# EAGLE design badge1 (EAGLE 7.3.0)
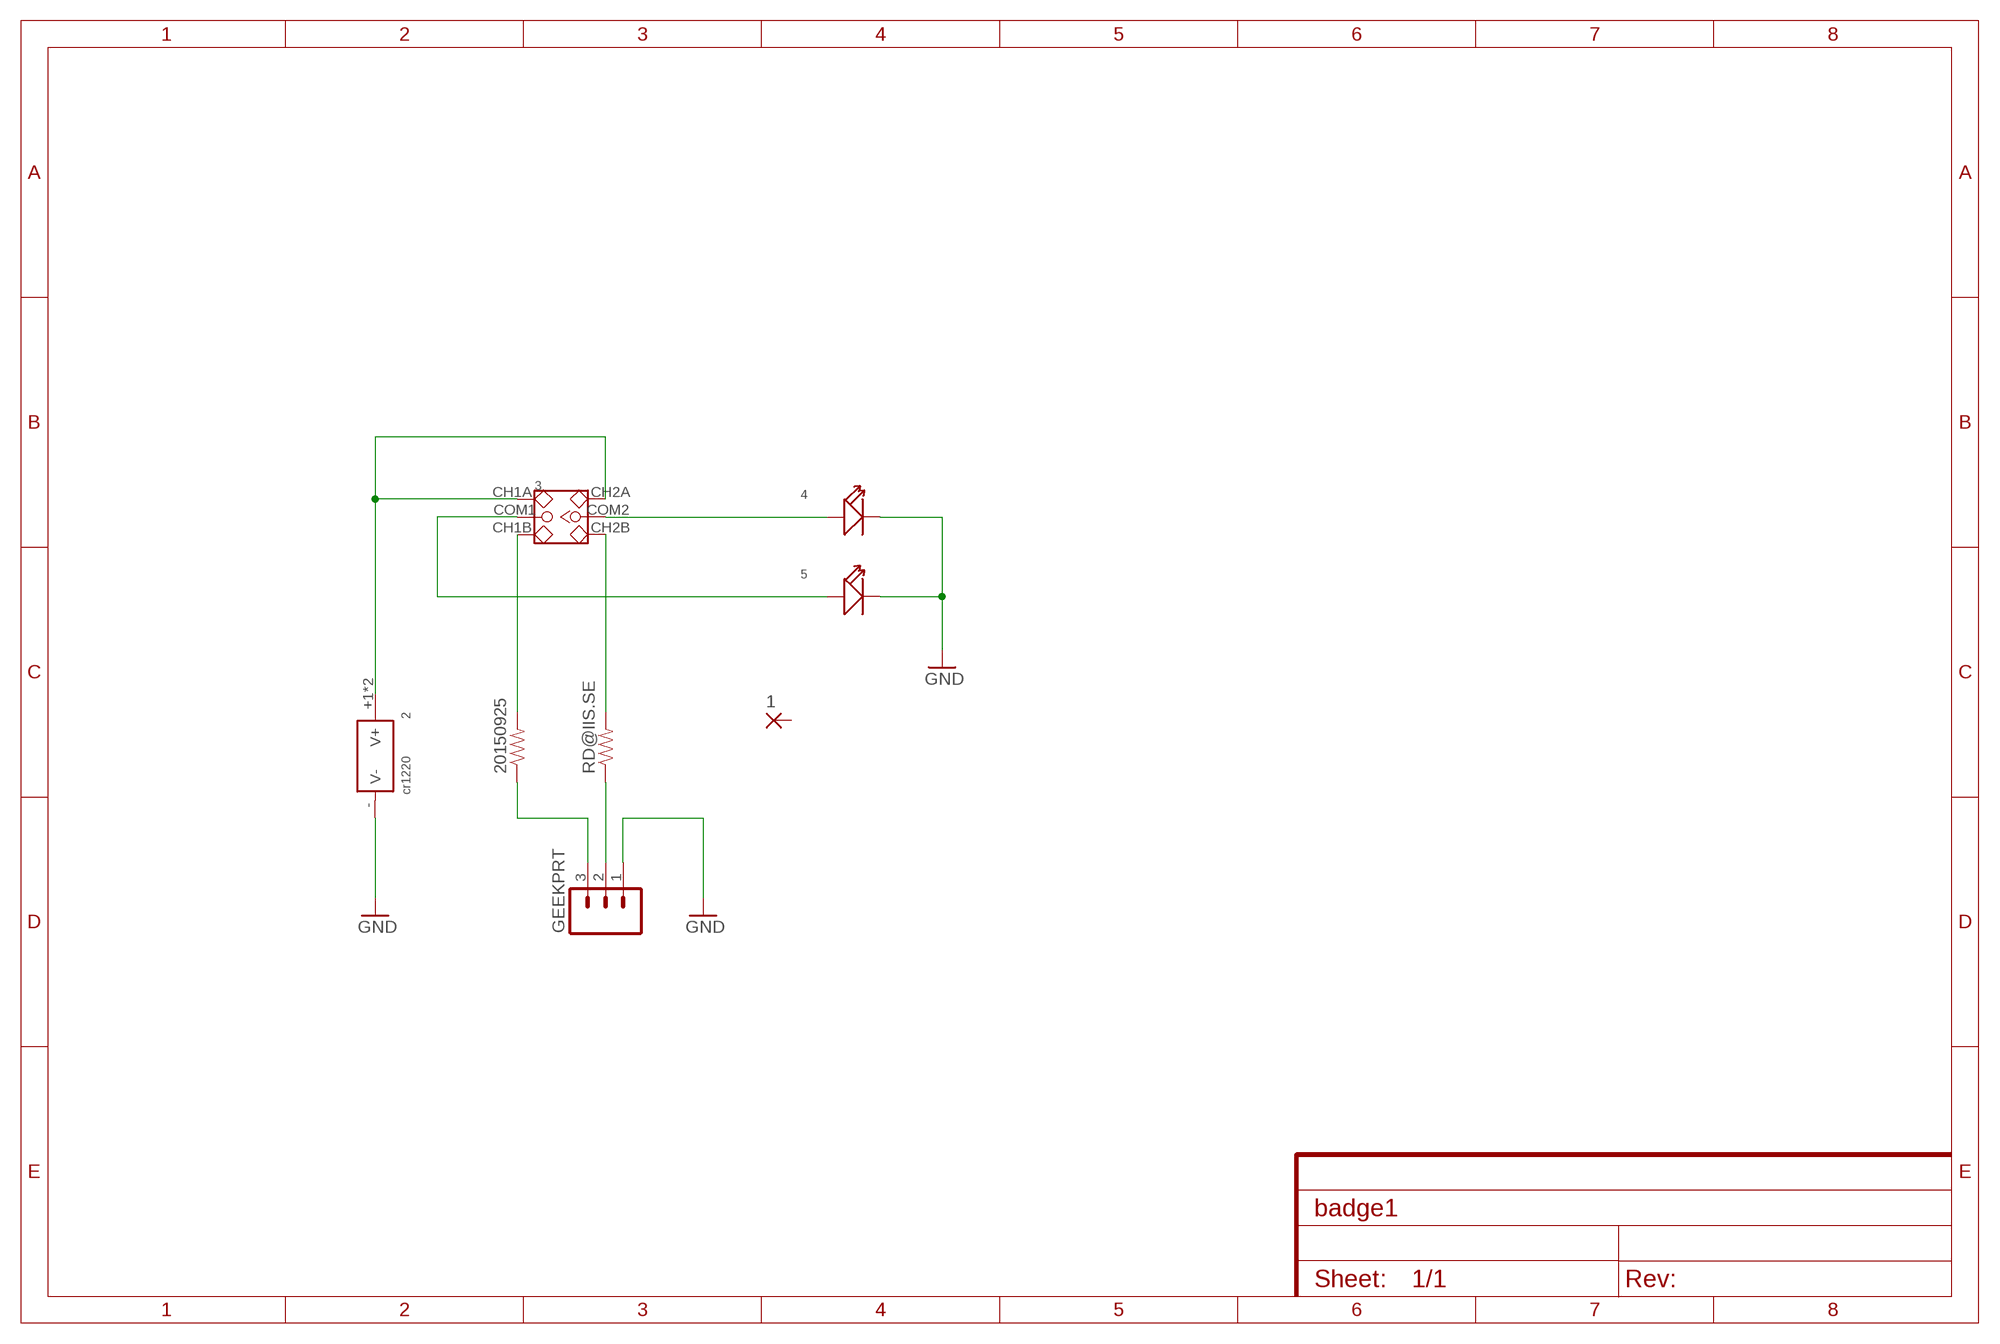
[diagram p0: schematic, sheet 1]

## Parts
1  3,81/1,4  [3,81/1,4]
2  cr1220  DIP-BATTERY-CELL-HOLDER(1220)  [BAT2P-13.5-CR1220]
3  DIP-TOGGLE-SWITCH-2CH-(2X3P-2.54-90D)'90D'  [SW6-2.54-9.0X3.5X3.2MM-90D]
4  LED'5MM'  [LED2-2.54-D5.0MM]
5  LED'5MM'  [LED2-2.54-D5.0MM]
20150925  RESISTORPTH-1/4W  [AXIAL-0.4]
GEEKPRT  M03LOCK  [1X03_LOCK]
RD@IIS.SE  RESISTORPTH-1/4W  [AXIAL-0.4]

## Nets
GND: 2.-(V-) 4.- 5.- GEEKPRT.1
N$1: 3.COM2 4.+
N$2: 3.COM1 5.+
N$3: 2.+1(V+) 2.+2(V+) 3.CH1A 3.CH2A
N$4: GEEKPRT.2 RD@IIS.SE.P$1
N$5: 3.CH1B 20150925.P$2
N$6: 3.CH2B RD@IIS.SE.P$2
N$7: 20150925.P$1 GEEKPRT.3
Unconnected: 1.1(P)

## Library data of the parts
1 = wirepad:3,81/1,4: THROUGH-HOLE PAD
2 = Seeed-OPL-Connector:DIP-BATTERY-CELL-HOLDER(1220): 320170002
3 = Seeed-OPL-Switch:DIP-TOGGLE-SWITCH-2CH-(2X3P-2.54-90D): 311030004
4 5 = Discrete-new:LED
20150925 RD@IIS.SE = SparkFun-Passives:RESISTOR: Resistor Basic schematic elements and footprints for 0603, 1206, and PTH resistors.
GEEKPRT = SparkFun-Connectors:M03: Header 3 Standard 3-pin 0.1" header. Use with straight break away headers (SKU : PRT-00116), right angle break away headers (PRT-00553), swiss pins (PRT-00743), machine pins (PRT-00117), and female headers (PRT-00115). Molex polarized connector foot print use with SKU : PRT-08232 with associated crimp pins and housings.

## Board
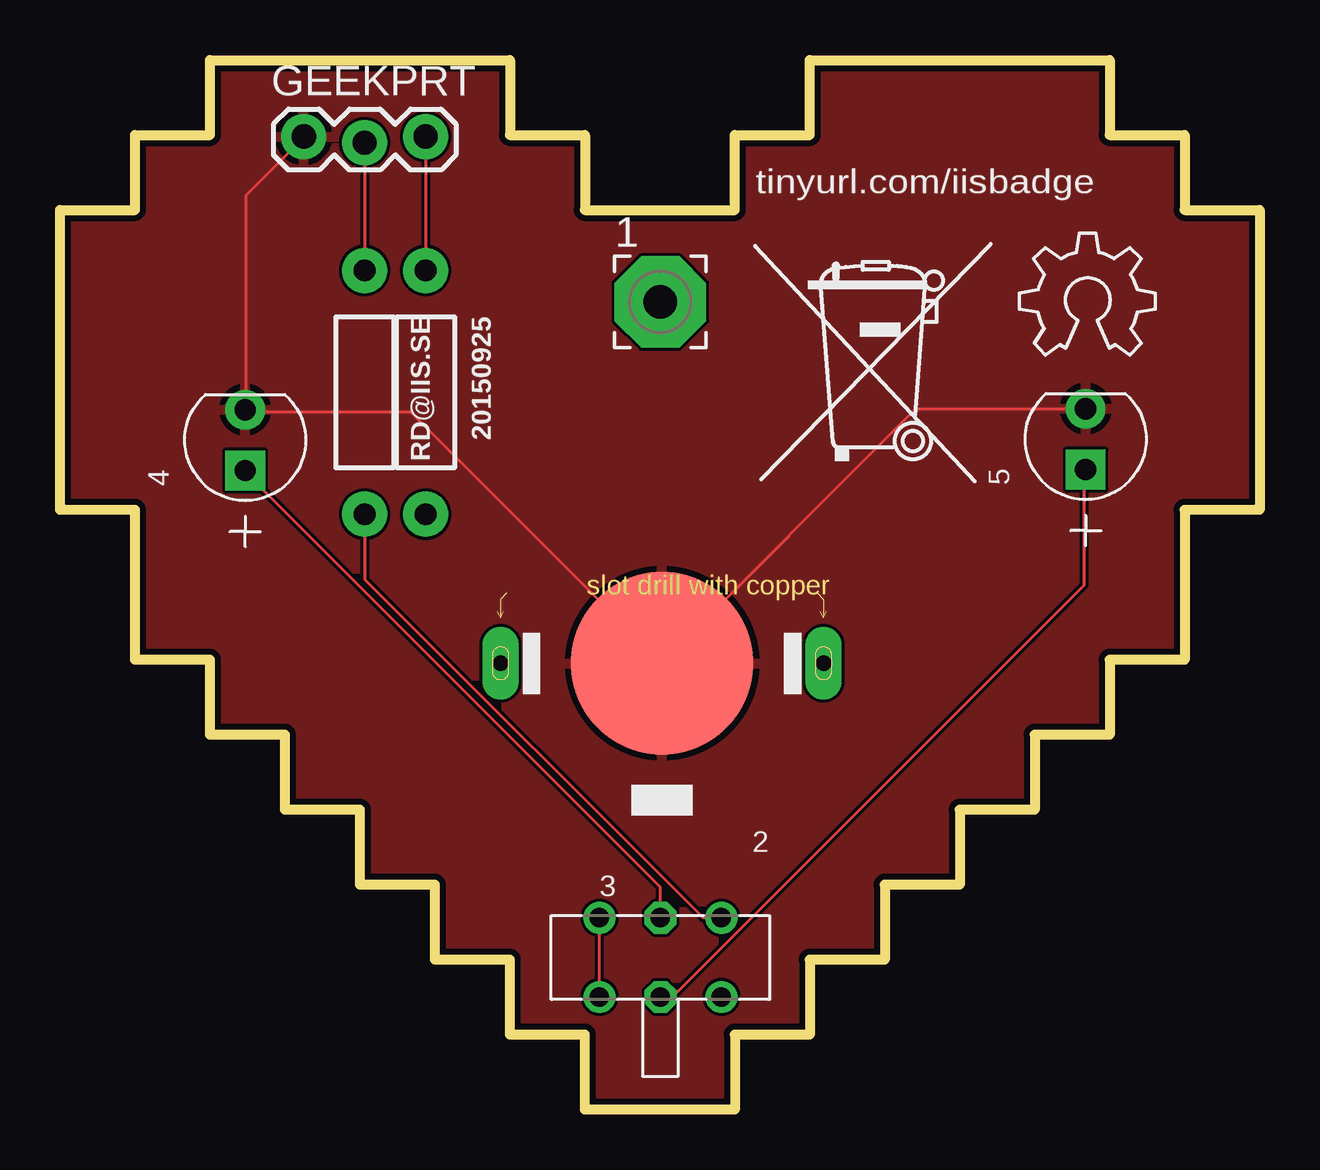
[diagram p1: board, top side]
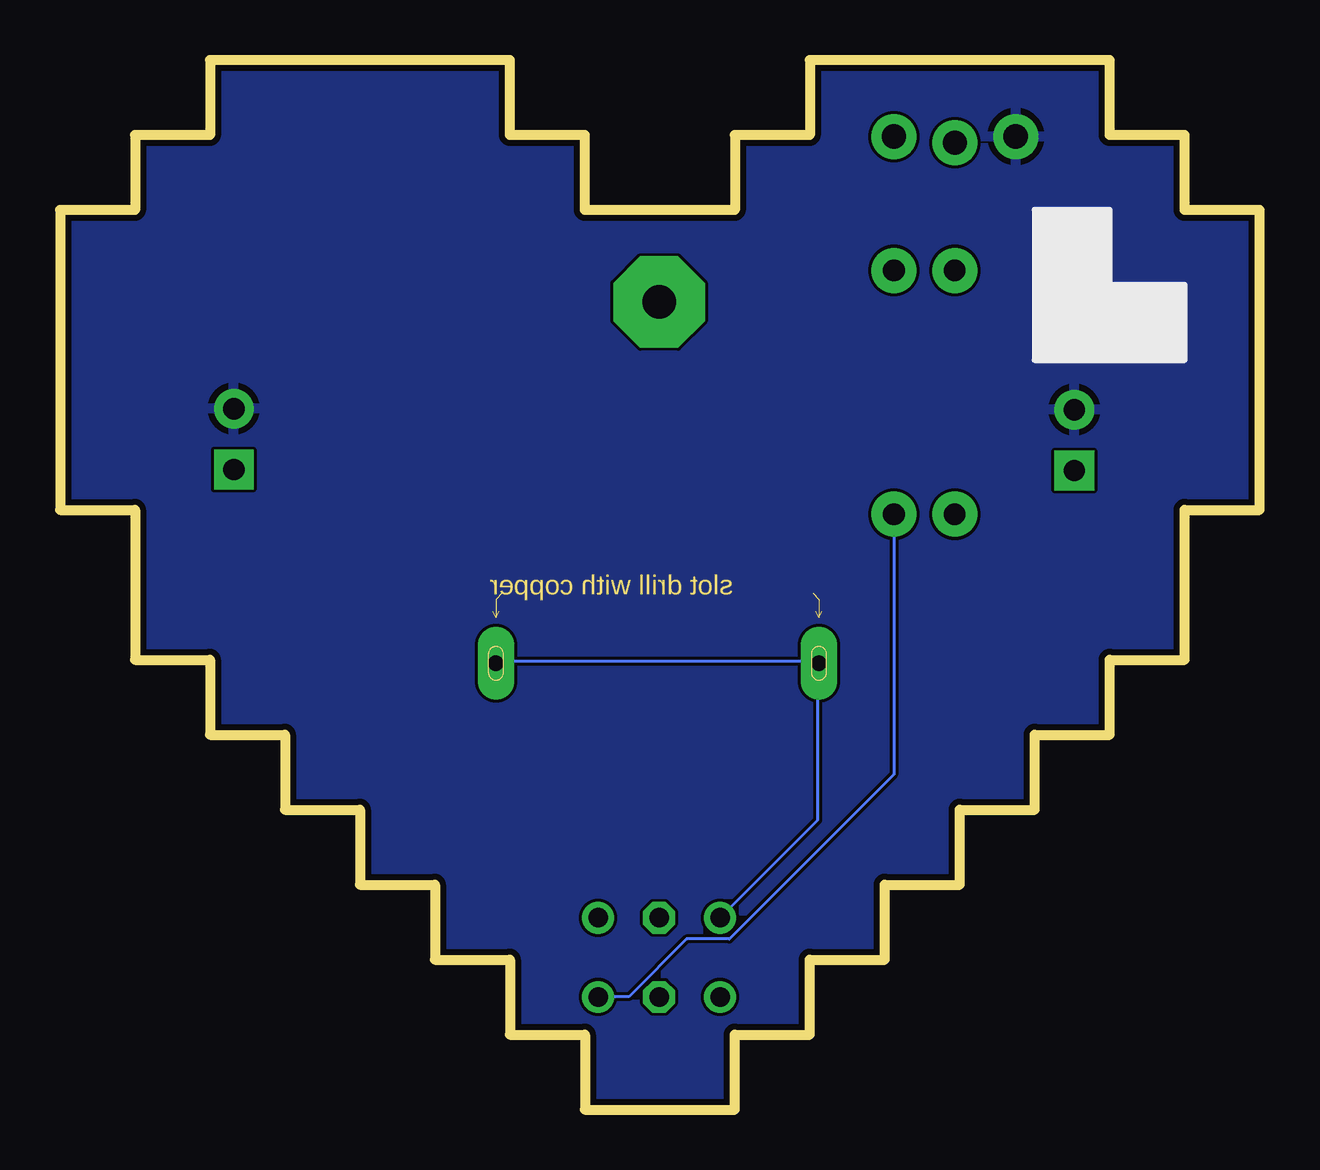
[diagram p2: board, bottom side, seen from below]

Size 50 x 43.75 mm. Coordinates in mm from the lower left corner, seen from the top.
Outline: 0,37.5 3.12,37.5 3.12,40.62 6.25,40.62 6.25,43.75 18.75,43.75 18.75,40.62 21.88,40.62 21.88,37.5 28.12,37.5 28.12,40.62 31.25,40.62 31.25,43.75 43.75,43.75 43.75,40.62 46.88,40.62 46.88,37.5 50,37.5 50,25 46.88,25 46.88,18.75 43.75,18.75 43.75,15.62 40.62,15.62 40.62,12.5 37.5,12.5 37.5,9.38 34.38,9.38 34.38,6.25 31.25,6.25 31.25,3.12 28.12,3.12 28.12,0 21.88,0 21.88,3.12 18.75,3.12 18.75,6.25 15.62,6.25 15.62,9.38 12.5,9.38 12.5,12.5 9.38,12.5 9.38,15.62 6.25,15.62 6.25,18.75 3.12,18.75 3.12,25 0,25 0,37.5
Copper layers (1*16): Top 0.035mm / dielectric 1.5mm / Bottom 0.035mm
Design rules "dirt_cheap_dirty_boards.v1": minimum track width 5mil, minimum drill 12mil, track to track 5mil, track to pad 5mil, pad to pad 5mil, via to via 5mil, smd to smd 0mil, copper to edge 10mil, drill to drill 10mil, minimum pad ring 10mil, minimum via ring 6mil, stop-mask expansion 2mil, vias tented up to drill 25mil, thermal gap 10mil

### Footprints (pad centres in the part's own frame; a part is rotated, then mirrored left to right if it is on the bottom)
3,81/1,4 = drill 1.397 pad 3.81 octagon: 1 0,0
BAT2P-13.5-CR1220 = drill 0.635 pad 1.524 long: +1 6.731,0; +2 -6.731,0 | smd 7.62 x 7.62: - 0,0
SW6-2.54-9.0X3.5X3.2MM-90D = drill 0.813 pad 1.27: CH1A -2.54,-1.65; CH1B 2.54,-1.65; CH2A -2.54,1.65; CH2B 2.54,1.65 | drill 0.813 pad 1.27 octagon: COM1 0,-1.65; COM2 0,1.65
LED2-2.54-D5.0MM = drill 0.889 pad 1.651 square: + -1.27,0 | drill 0.889 pad 1.651: - 1.27,0
AXIAL-0.4 = drill 0.9 pad 1.88: P$1 -5.08,0; P$2 5.08,0
1X03_LOCK = drill 1.016 pad 1.88: 1 0,0.127; 2 2.54,-0.127; 3 5.08,0.127

### Placement (x,y rotation side)
1  25.03,33.66 0 top
2  25.1,18.6 180 top
3  25.03,6.34 0 top
4  7.72,27.9 90 top
5  42.75,27.94 90 top
20150925  15.24,29.89 270 top
GEEKPRT  10.16,40.43 0 top
RD@IIS.SE  12.7,29.89 270 top
U$1  [OSHW_6X200_NOTEXT]  40,31.46 0 top
U$3  [MUELLTONNE_10.00]  28.31,25.77 0 top

### Tracks (layer width: path | path; a pad name or v marks a point on that pad's centre or on a via)
GND
  Top 0.127: GEEKPRT.1 10.16,40.51 7.75,38.1 7.75,29.21 4.- 7.75,29.08 14.61,29.08 25.02,18.67 2.- 25.15,18.67 35.69,29.21 42.67,29.21 5.-
  pour Top: -9.38,50 56.25,50 56.25,-3.12 -9.38,-3.12
  pour Bottom: -12.5,53.12 56.25,53.12 56.25,50 56.25,-6.25 -12.5,-6.25
N$1
  Top 0.127: 3.COM2 25.02,8 25.02,9.27 7.75,26.54 4.+
N$2
  Top 0.127: 3.COM1 25.15,4.7 25.53,4.7 42.67,21.84 42.67,26.67 5.+
N$3
  Top 0.127: 3.CH1A 22.48,4.7 22.48,7.87 3.CH2A
  Bottom 0.127: 3.CH2A 22.48,8 18.41,12.06 18.41,18.54 2.+1 18.41,18.67 31.75,18.67 2.+2
N$4
  Top 0.127: GEEKPRT.2 RD@IIS.SE.P$1
N$5
  Bottom 0.127: 20150925.P$2 15.24,13.97 22.1,7.11 23.88,7.11 26.29,4.7 3.CH1B
N$6
  Top 0.127: RD@IIS.SE.P$2 12.7,22.1 26.8,8 3.CH2B
N$7
  Top 0.127: GEEKPRT.3 20150925.P$1

### Text on the board
tPlace: tinyurl.com/iisbadge